# EasyEDA Pro project ByByte_nano.epro, schematic LineTracker_SCH
Board Name: LineTracker; Create Date: 2026-06-02; Page Name: P1; Project Name: Бабай (ByByte) Nano; Schematic Name: LineTracker_SCH; Update Date: 2026-06-02; Company: EasyEDA.com; Page Size: A4; Version: V1.0
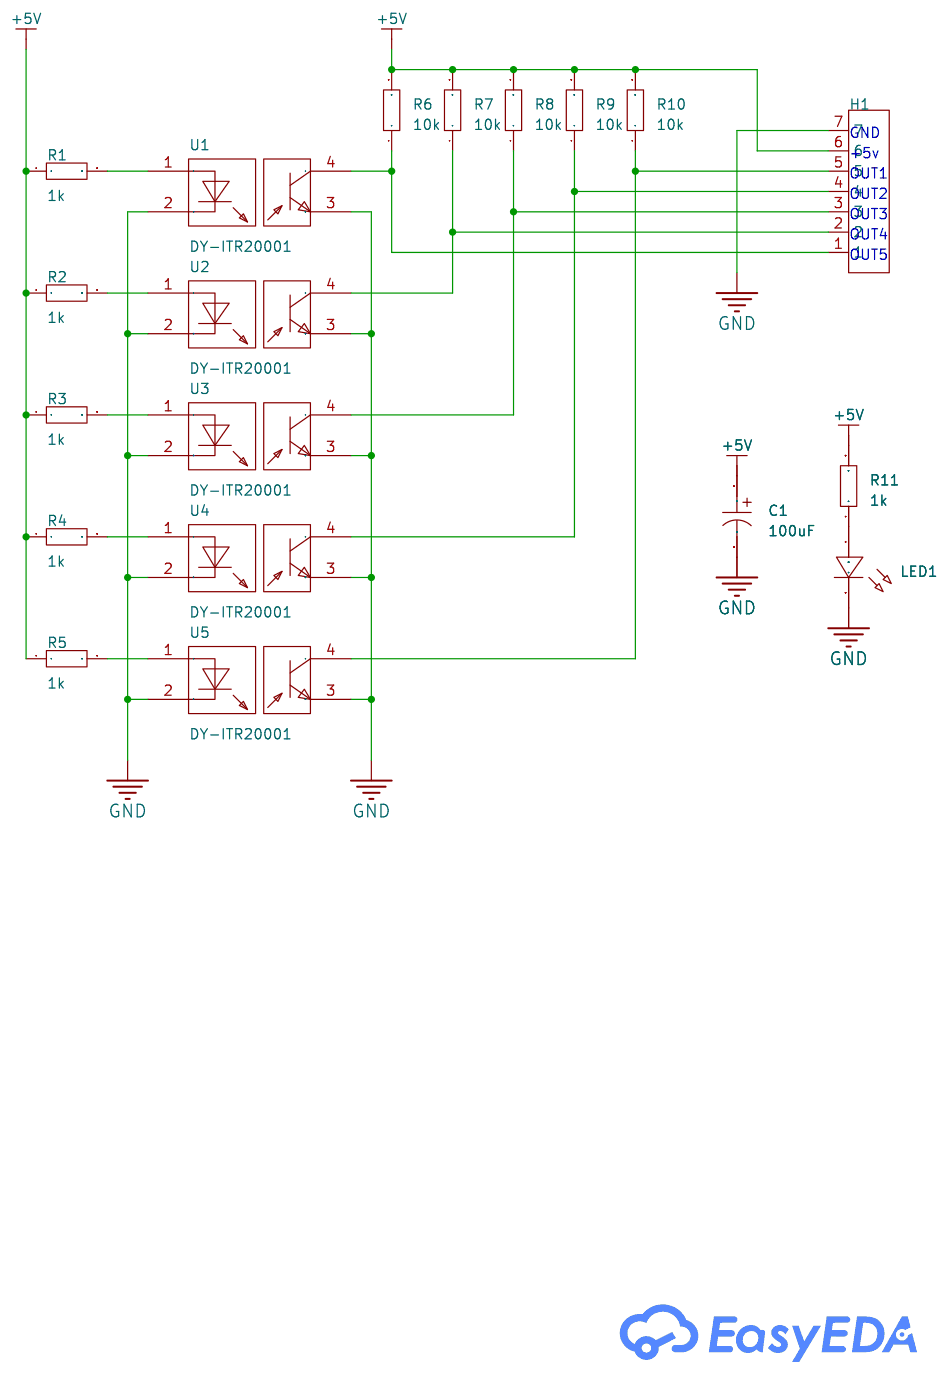
[diagram p1: schematic sheet]

## Parts
C1  100uF  [CAP-TH_BD6.3-P2.5-D0.6-FD-RYHG35V100UF]
H1  KH-2.54PH90-1X7P-L13.8  [HDR-TH_7P-P2.54-H-M-W10.4-N]
LED1  -  [LED-TH_BD3.0-P2.54-FD]
R1  1k  [RES-TH_BD1.8-L3.2-P7.20-D0.4]
R2  1k  [RES-TH_BD1.8-L3.2-P7.20-D0.4]
R3  1k  [RES-TH_BD1.8-L3.2-P7.20-D0.4]
R4  1k  [RES-TH_BD1.8-L3.2-P7.20-D0.4]
R5  1k  [RES-TH_BD1.8-L3.2-P7.20-D0.4]
R6  10k  [RES-TH_BD1.8-L3.2-P7.20-D0.4]
R7  10k  [RES-TH_BD1.8-L3.2-P7.20-D0.4]
R8  10k  [RES-TH_BD1.8-L3.2-P7.20-D0.4]
R9  10k  [RES-TH_BD1.8-L3.2-P7.20-D0.4]
R10  10k  [RES-TH_BD1.8-L3.2-P7.20-D0.4]
R11  1k  [RES-TH_BD1.8-L3.2-P7.20-D0.4]
U1  DY-ITR20001  [OPTO-TH_DY-ITR20001]
U2  DY-ITR20001  [OPTO-TH_DY-ITR20001]
U3  DY-ITR20001  [OPTO-TH_DY-ITR20001]
U4  DY-ITR20001  [OPTO-TH_DY-ITR20001]
U5  DY-ITR20001  [OPTO-TH_DY-ITR20001]

## Library data of the parts
C1 = RYHG35V100UF6*8: Capacitance:100uF Voltage Rating:35V Ripple Current:2.25A@100kHz Equivalent Series Resistance(ESR):38mΩ@100kHz Type:Polymer Diameter:6.3mm Height - Seated (Max):8mm Lifetime:2000hrs@105℃; LCSC Part Name: 100uF 35V; Supplier Part: C48970442; Manufacturer: HONOR(荣誉); Supplier Footprint: 插件,D6.3xL8mm; JLCPCB Part Class: Extended Part; Datasheet: https://item.szlcsc.com/datasheet/RYHG35V100UF6*8/51295386.html; Supplier: LCSC; Voltage Rating: 35V; Ripple Current: 2.25A@100kHz; Equivalent Series Resistance(ESR): 38mΩ@100kHz; Type: Polymer; Diameter: 6.3mm; Height - Seated (Max): 8mm; Lifetime: 2000hrs@105℃
H1 = KH-2.54PH90-1X7P-L13.8: Pin Structure:1x7P Pitch:2.54mm Row Spacing:- Circluar Pins/Square Pins:Pin Header Mounting Type:Right Angle Number of Rows:1 Number of Pins:7P Current Rating:3A Voltage Rating (Max):- Length of Mating Pin:6mm Insulation Height:2.5mm Length of End Connect; LCSC Part Name: 1x7P 间距:2.54mm 方针 弯插; Supplier Part: C2932691; Manufacturer: kinghelm(金航标); Supplier Footprint: 弯插,P=2.54mm; JLCPCB Part Class: Extended Part; Datasheet: https://item.szlcsc.com/datasheet/KH-2.54PH90-1X7P-L13.8/3278212.html; Supplier: LCSC; Pin Structure: 1x7P; Pitch: 2.54mm; Circluar Pins/Square Pins: Pin Header; Mounting Type: Right Angle; Number of Rows: 1; Number of Pins: 7P; Current Rating: 3A; Length of Mating Pin: 6mm; Insulation Height: 2.5mm; Operating Temperature: -40℃~+105℃; Color: Black
LED1 = LED_TH-R_3mm: PWR; Supplier Footprint: Through
R1-R11 = Res_AXIAL-1/8W: Supplier Footprint: Through
U1-U5 = DY-ITR20001: LCSC Part Name: DY-ITR20001 L等级 停产; Supplier Part: C459138; Manufacturer: TONYU(东裕); Supplier Footprint: 插件; JLCPCB Part Class: Extended Part; Datasheet: https://atta.szlcsc.com/upload/public/pdf/source/20191121/C459138_4248E56B05759D7BA5085FE48728ABDF.pdf; Supplier: LCSC

## Nets
+5V: C1.1 H1.6 R1.1 R2.1 R3.1 R4.1 R5.1 R6.2 R7.2 R8.2 R9.2 R10.2 R11.2
GND: C1.2 H1.7 LED1.2(A) U1.2 U1.3 U2.2 U2.3 U3.2 U3.3 U4.2 U4.3 U5.2 U5.3
$1N740: R1.2 U1.1
$1N745: R2.2 U2.1
$1N750: R3.2 U3.1
$1N755: R4.2 U4.1
$1N760: R5.2 U5.1
$1N967: H1.1 R6.1 U1.4
$1N973: H1.2 R7.1 U2.4
$1N979: H1.3 R8.1 U3.4
$1N985: H1.4 R9.1 U4.4
$1N991: H1.5 R10.1 U5.4
$1N1528: LED1.1(C) R11.1

## Notes on the sheet
- GND
- +5v
- OUT1
- OUT2
- OUT3
- OUT4
- OUT5
